# Altium project arm.PrjPcb
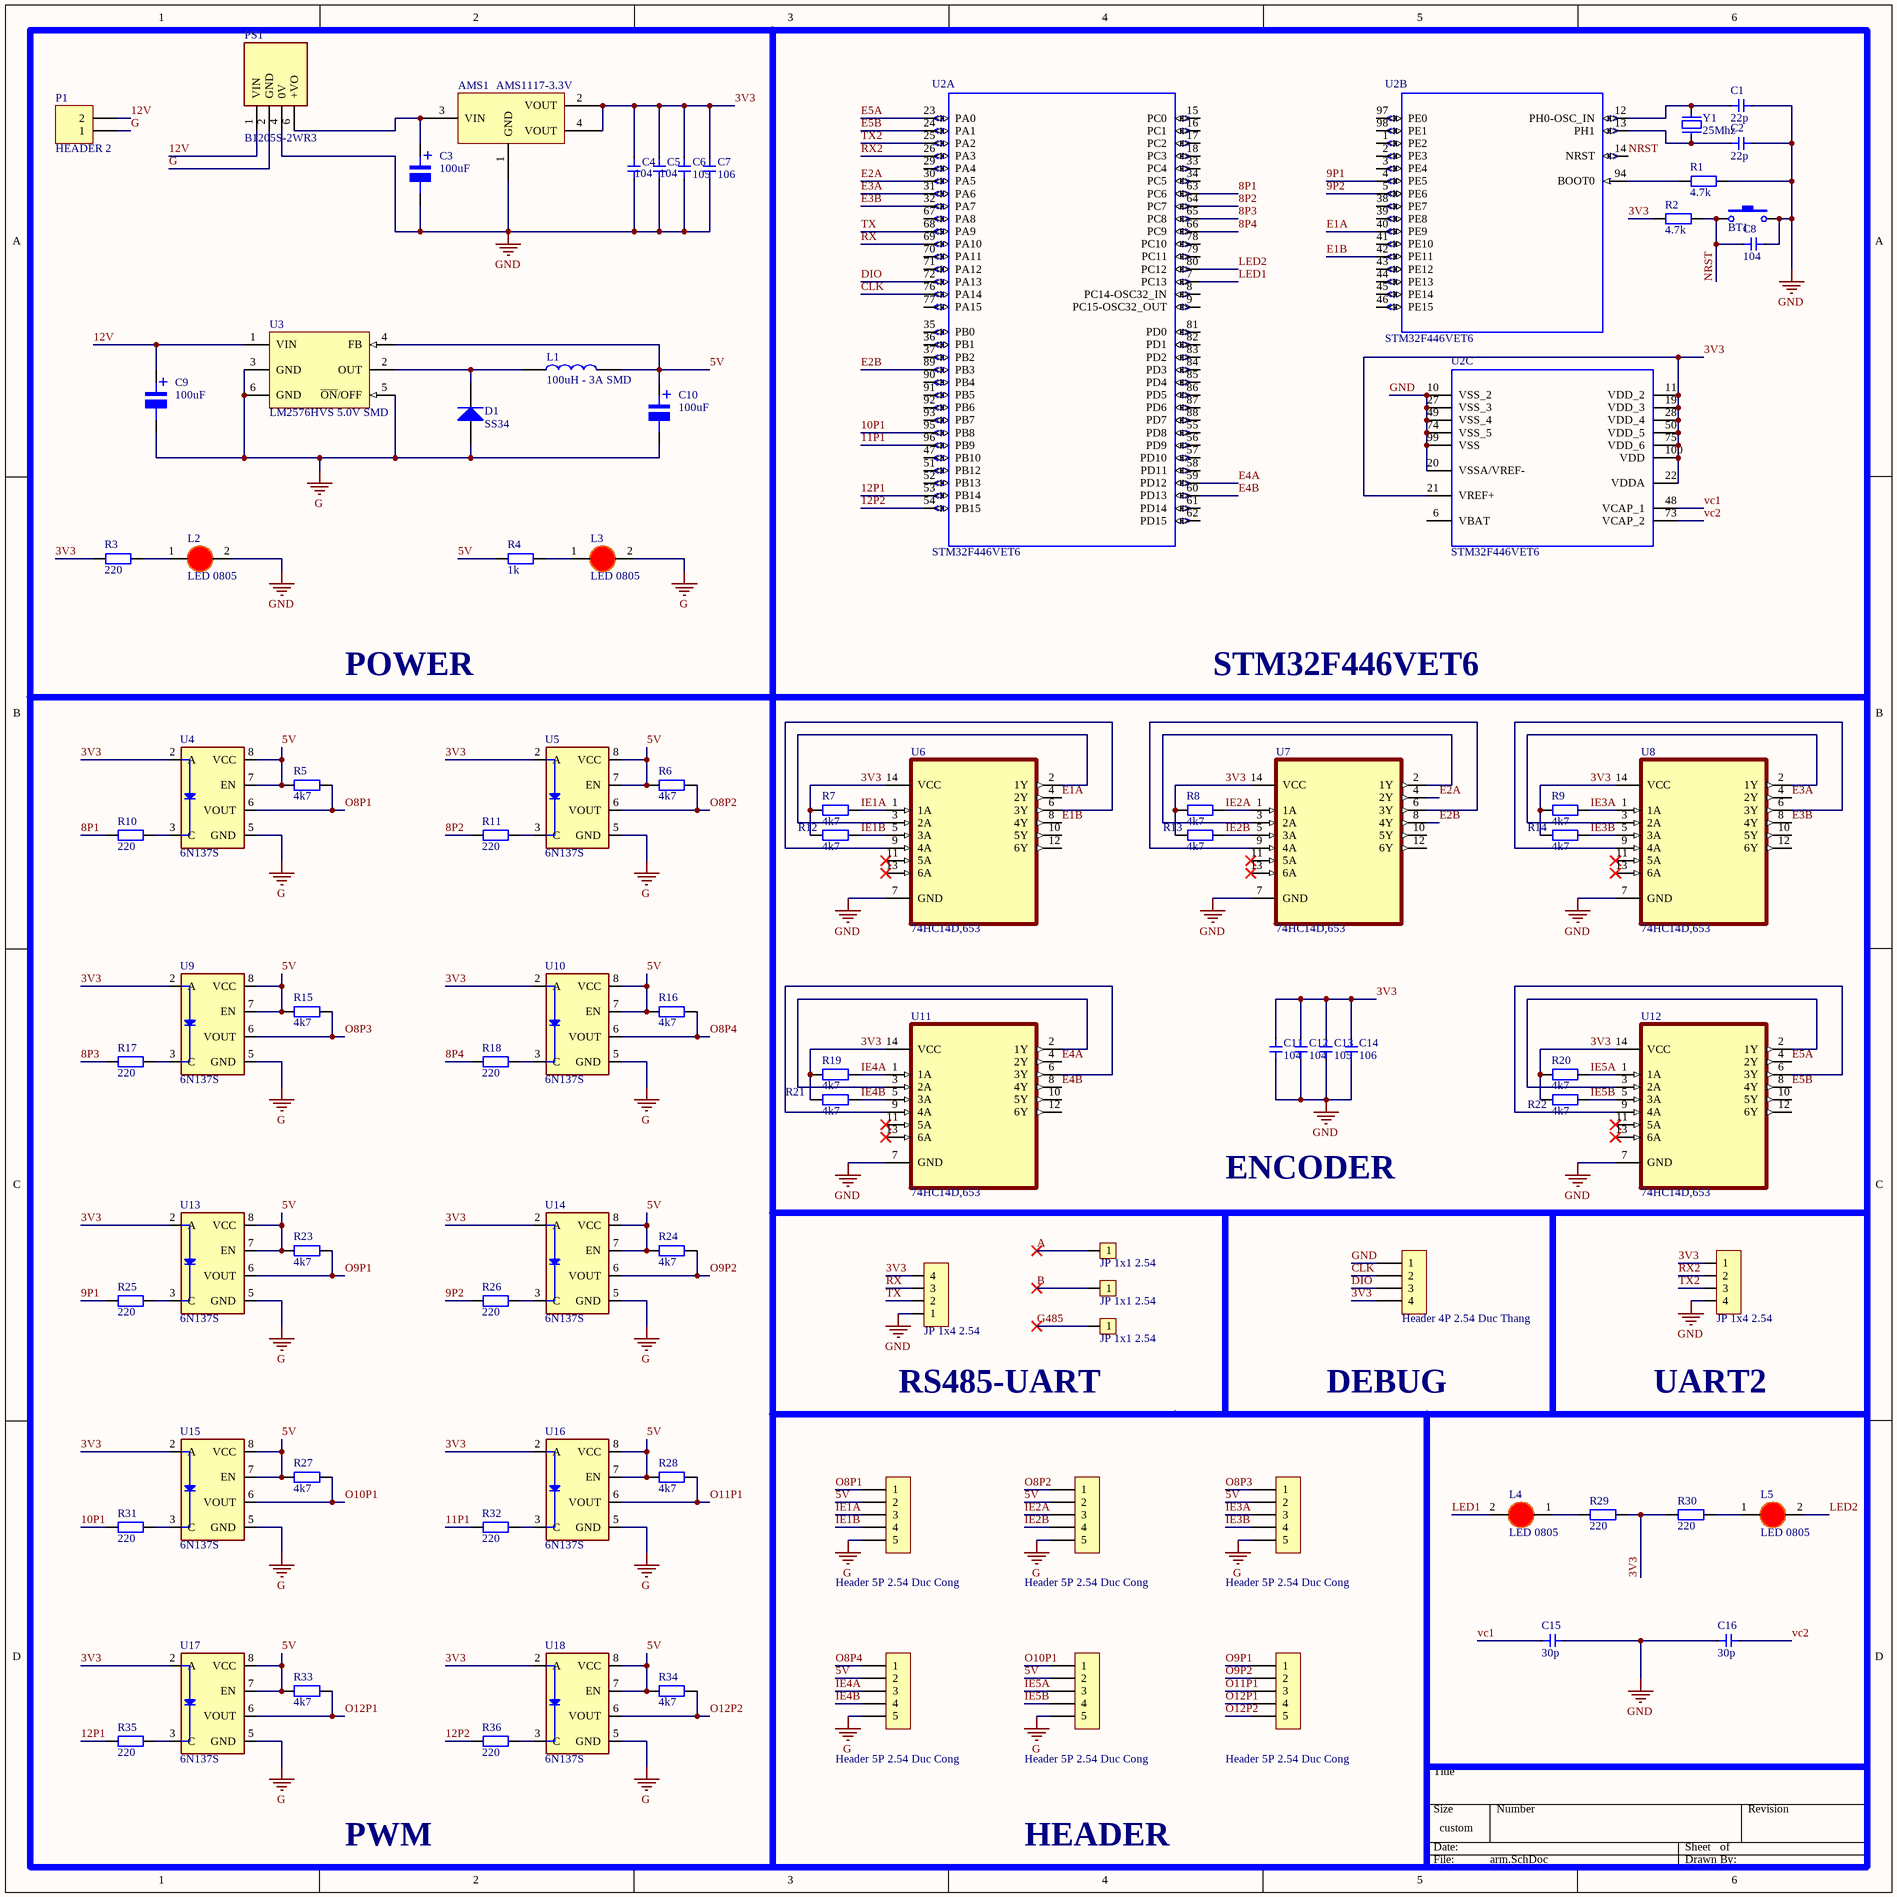
[diagram p0: arm.SchDoc]
1 sheet, 92 parts. Net scope: global (net labels, ports and power ports of the same name join across sheets).
Board file: arm.PcbDoc

## Sheet arm.SchDoc
size 381 x 381 mm; SheetNumber: 1; SheetTotal: 1

### Parts
AMS1  AMS1117-3.3V  [SOT223]
BT1  Nut Nhan 2 Chan SMD 3x6x2.5  [Nut Nhan 2 Chan SMD 3x6x2.5]  (value not drawn)
C1  22p  [Cap 0805]
C2  22p  [Cap 0805]
C3  100uF  [tu nhom 6.3 (d)]
C4  104  [Cap 0805]
C5  104  [Cap 0805]
C6  105  [Cap 0805]
C7  106  [Cap 0805]
C8  104  [Cap 0805]
C9  100uF  [tu nhom 6.3 (d)]
C10  100uF  [tu nhom 6.3 (d)]
C11  104  [Cap 0805]
C12  104  [Cap 0805]
C13  105  [Cap 0805]
C14  106  [Cap 0805]
C15  30p  [Cap 0805]
C16  30p  [Cap 0805]
D1  SS34  [DIODE SMA]
H1  Header 4P 2.54 Duc Thang  [XH2.54M-4]
H2  Header 5P 2.54 Duc Cong  [Header 5P DC 2.54]
H3  Header 5P 2.54 Duc Cong  [Header 5P DC 2.54]
H4  Header 5P 2.54 Duc Cong  [Header 5P DC 2.54]
H5  Header 5P 2.54 Duc Cong  [Header 5P DC 2.54]
H6  Header 5P 2.54 Duc Cong  [Header 5P DC 2.54]
H7  Header 5P 2.54 Duc Cong  [Header 5P DC 2.54]
JP1  JP 1x1 2.54  [JP 1x1 DT]
JP2  JP 1x4 2.54  [JP 1x4 DT]
JP3  JP 1x4 2.54  [JP 1x4 DT]
JP4  JP 1x1 2.54  [JP 1x1 DT]
JP5  JP 1x1 2.54  [JP 1x1 DT]
L1  100uH - 3A SMD  [Cuon Cam 12x12x10]
L2  LED 0805  [LED-0805-Red]
L3  LED 0805  [LED-0805-Red]
L4  LED 0805  [LED-0805-Red]
L5  LED 0805  [LED-0805-Red]
P1  HEADER 2  [CON 2]
PS1  B1205S-2WR3  [B1205S2WR3]
R1  4.7k  [tro smd 0805]
R2  4.7k  [tro smd 0805]
R3  220  [tro smd 0805]
R4  1k  [tro smd 0805]
R5  4k7  [tro smd 0805]
R6  4k7  [tro smd 0805]
R7  4k7  [tro smd 0805]
R8  4k7  [tro smd 0805]
R9  4k7  [tro smd 0805]
R10  220  [tro smd 0805]
R11  220  [tro smd 0805]
R12  4k7  [tro smd 0805]
R13  4k7  [tro smd 0805]
R14  4k7  [tro smd 0805]
R15  4k7  [tro smd 0805]
R16  4k7  [tro smd 0805]
R17  220  [tro smd 0805]
R18  220  [tro smd 0805]
R19  4k7  [tro smd 0805]
R20  4k7  [tro smd 0805]
R21  4k7  [tro smd 0805]
R22  4k7  [tro smd 0805]
R23  4k7  [tro smd 0805]
R24  4k7  [tro smd 0805]
R25  220  [tro smd 0805]
R26  220  [tro smd 0805]
R27  4k7  [tro smd 0805]
R28  4k7  [tro smd 0805]
R29  220  [tro smd 0805]
R30  220  [tro smd 0805]
R31  220  [tro smd 0805]
R32  220  [tro smd 0805]
R33  4k7  [tro smd 0805]
R34  4k7  [tro smd 0805]
R35  220  [tro smd 0805]
R36  220  [tro smd 0805]
U2  STM32F446VET6  [LQFP100-14X14MM]  (parts A,B,C of 3)
U3  LM2576HVS 5.0V SMD  [TO263-5]
U4  6N137S  [8-SMD]
U5  6N137S  [8-SMD]
U6  74HC14D,653  [SOIC127P600X175-14N]
U7  74HC14D,653  [SOIC127P600X175-14N]
U8  74HC14D,653  [SOIC127P600X175-14N]
U9  6N137S  [8-SMD]
U10  6N137S  [8-SMD]
U11  74HC14D,653  [SOIC127P600X175-14N]
U12  74HC14D,653  [SOIC127P600X175-14N]
U13  6N137S  [8-SMD]
U14  6N137S  [8-SMD]
U15  6N137S  [8-SMD]
U16  6N137S  [8-SMD]
U17  6N137S  [8-SMD]
U18  6N137S  [8-SMD]
Y1  25Mhz  [Thach Anh 2 chan cam]

### Blocks framed on the sheet
POWER: AMS1 C3-C7 C9 C10 D1 L1-L3 P1 PS1 R3 R4 U3

### Nets
G: C9.2 C10.2 D1.1(A) H2.5 H3.5 H4.5 H5.5 H6.5 L3.2(K) P1.1 PS1.2(GND) U3.3(GND) U3.5(~{ON}/OFF) U3.6(GND) U4.5(GND) U5.5(GND) U9.5(GND) U10.5(GND) U13.5(GND) U14.5(GND) U15.5(GND) U16.5(GND) U17.5(GND) U18.5(GND)
GND: AMS1.1(GND) BT1.2 C1.2 C2.2 C3.2 C4.2 C5.2 C6.2 C7.2 C8.2 C11.2 C12.2 C13.2 C14.2 C15.2 C16.1 H1.1 JP2.1 JP3.4 L2.2(K) PS1.4(0V) R1.2 U2.10(VSS_2) U2.20(VSSA/VREF-) U2.27(VSS_3) U2.49(VSS_4) U2.74(VSS_5) U2.99(VSS) U6.7(GND) U7.7(GND) U8.7(GND) U11.7(GND) U12.7(GND)
3V3: AMS1.2(VOUT) AMS1.4(VOUT) C4.1 C5.1 C6.1 C7.1 C11.1 C12.1 C13.1 C14.1 H1.4 JP2.4 JP3.1 R2.2 R3.1 R7.1 R8.1 R9.1 R12.1 R13.1 R14.1 R19.1 R20.1 R21.1 R22.1 R29.2 R30.1 U2.11(VDD_2) U2.19(VDD_3) U2.21(VREF+) U2.22(VDDA) U2.28(VDD_4) U2.50(VDD_5) U2.75(VDD_6) U2.100(VDD) U4.2(A) U5.2(A) U6.14(VCC) U7.14(VCC) U8.14(VCC) U9.2(A) U10.2(A) U11.14(VCC) U12.14(VCC) U13.2(A) U14.2(A) U15.2(A) U16.2(A) U17.2(A) U18.2(A)
5V: C10.1 H2.2 H3.2 H4.2 H5.2 H6.2 L1.2 R4.1 R5.1 R6.1 R15.1 R16.1 R23.1 R24.1 R27.1 R28.1 R33.1 R34.1 U3.4(FB) U4.7(EN) U4.8(VCC) U5.7(EN) U5.8(VCC) U9.7(EN) U9.8(VCC) U10.7(EN) U10.8(VCC) U13.7(EN) U13.8(VCC) U14.7(EN) U14.8(VCC) U15.7(EN) U15.8(VCC) U16.7(EN) U16.8(VCC) U17.7(EN) U17.8(VCC) U18.7(EN) U18.8(VCC)
8P1: R10.1 U2.63(PC6)
8P2: R11.1 U2.64(PC7)
8P3: R17.1 U2.65(PC8)
8P4: R18.1 U2.66(PC9)
9P1: R25.1 U2.4(PE5)
9P2: R26.1 U2.5(PE6)
10P1: R31.1 U2.95(PB8)
11P1: R32.1 U2.96(PB9)
12P1: R35.1 U2.53(PB14)
12P2: R36.1 U2.54(PB15)
12V: C9.1 P1.2 PS1.1(VIN) U3.1(VIN)
A: JP1.1
B: JP4.1
CLK: H1.2 U2.76(PA14)
DIO: H1.3 U2.72(PA13)
E1A: U2.40(PE9) U6.4(2Y)
E1B: U2.42(PE11) U6.8(4Y)
E2A: U2.30(PA5) U7.4(2Y)
E2B: U2.89(PB3) U7.8(4Y)
E3A: U2.31(PA6) U8.4(2Y)
E3B: U2.32(PA7) U8.8(4Y)
E4A: U2.59(PD12) U11.4(2Y)
E4B: U2.60(PD13) U11.8(4Y)
E5A: U2.23(PA0) U12.4(2Y)
E5B: U2.24(PA1) U12.8(4Y)
G485: JP5.1
IE1A: H2.3 R7.2 U6.1(1A)
IE1B: H2.4 R12.2 U6.5(3A)
IE2A: H3.3 R8.2 U7.1(1A)
IE2B: H3.4 R13.2 U7.5(3A)
IE3A: H4.3 R9.2 U8.1(1A)
IE3B: H4.4 R14.2 U8.5(3A)
IE4A: H5.3 R19.2 U11.1(1A)
IE4B: H5.4 R21.2 U11.5(3A)
IE5A: H6.3 R20.2 U12.1(1A)
IE5B: H6.4 R22.2 U12.5(3A)
LED1: L4.2(K) U2.7(PC13)
LED2: L5.2(K) U2.80(PC12)
NRST: BT1.1 C8.1 R2.1 U2.14(NRST)
O8P1: H2.1 R5.2 U4.6(VOUT)
O8P2: H3.1 R6.2 U5.6(VOUT)
O8P3: H4.1 R15.2 U9.6(VOUT)
O8P4: H5.1 R16.2 U10.6(VOUT)
O9P1: H7.1 R23.2 U13.6(VOUT)
O9P2: H7.2 R24.2 U14.6(VOUT)
O10P1: H6.1 R27.2 U15.6(VOUT)
O11P1: H7.3 R28.2 U16.6(VOUT)
O12P1: H7.4 R33.2 U17.6(VOUT)
O12P2: H7.5 R34.2 U18.6(VOUT)
RX: JP2.3 U2.69(PA10)
RX2: JP3.2 U2.26(PA3)
TX: JP2.2 U2.68(PA9)
TX2: JP3.3 U2.25(PA2)
vc1: C15.1 U2.48(VCAP_1)
vc2: C16.2 U2.73(VCAP_2)
NetAMS1_3: AMS1.3(VIN) C3.1 PS1.6(+VO)
NetC1_1: C1.1 U2.12(PH0-OSC_IN) Y1.2
NetC2_1: C2.1 U2.13(PH1) Y1.1
NetD1_2: D1.2(K) L1.1 U3.2(OUT)
NetL2_1: L2.1(A) R3.2
NetL3_1: L3.1(A) R4.2
NetL4_1: L4.1(A) R29.1
NetL5_1: L5.1(A) R30.2
NetR1_1: R1.1 U2.94(BOOT0)
NetR10_2: R10.2 U4.3(C)
NetR11_2: R11.2 U5.3(C)
NetR17_2: R17.2 U9.3(C)
NetR18_2: R18.2 U10.3(C)
NetR25_2: R25.2 U13.3(C)
NetR26_2: R26.2 U14.3(C)
NetR31_2: R31.2 U15.3(C)
NetR32_2: R32.2 U16.3(C)
NetR35_2: R35.2 U17.3(C)
NetR36_2: R36.2 U18.3(C)
NetU6_2: U6.2(1Y) U6.3(2A)
NetU6_6: U6.6(3Y) U6.9(4A)
NetU7_2: U7.2(1Y) U7.3(2A)
NetU7_6: U7.6(3Y) U7.9(4A)
NetU8_2: U8.2(1Y) U8.3(2A)
NetU8_6: U8.6(3Y) U8.9(4A)
NetU11_2: U11.2(1Y) U11.3(2A)
NetU11_6: U11.6(3Y) U11.9(4A)
NetU12_2: U12.2(1Y) U12.3(2A)
NetU12_6: U12.6(3Y) U12.9(4A)

Not connected (* = marked no-connect by the designer): U2 1(PE2) 2(PE3) 3(PE4) 6(VBAT) 8(PC14-OSC32_IN) 9(PC15-OSC32_OUT) 15(PC0) 16(PC1) 17(PC2) 18(PC3) 29(PA4) 33(PC4) 34(PC5) 35(PB0) 36(PB1) 37(PB2) 38(PE7) 39(PE8) 41(PE10) 43(PE12) 44(PE13) 45(PE14) 46(PE15) 47(PB10) 51(PB12) 52(PB13) 55(PD8) 56(PD9) 57(PD10) 58(PD11) 61(PD14) 62(PD15) 67(PA8) 70(PA11) 71(PA12) 77(PA15) 78(PC10) 79(PC11) 81(PD0) 82(PD1) 83(PD2) 84(PD3) 85(PD4) 86(PD5) 87(PD6) 88(PD7) 90(PB4) 91(PB5) 92(PB6) 93(PB7) 97(PE0) 98(PE1); U6 10(5Y) 11(5A)* 12(6Y) 13(6A)*; U7 10(5Y) 11(5A)* 12(6Y) 13(6A)*; U8 10(5Y) 11(5A)* 12(6Y) 13(6A)*; U11 10(5Y) 11(5A)* 12(6Y) 13(6A)*; U12 10(5Y) 11(5A)* 12(6Y) 13(6A)*

### Notes on the sheet
- STM32F446VET6
- ENCODER
- RS485-UART
- DEBUG
- UART2
- PWM
- HEADER
- (in symbol Tu Nhom 100uF 16V) +
- (in symbol Tu Nhom 100uF 25V) +

### Library data of the parts
AMS1 = AMS1117 SMD: Dán; Value: AMS1117-3.3V SOT223; Don_Vi: Con; Ma_Hang: MH000596; Ghi_Chu: *; Kieu_Chan: *; Chung_Loai: Dán
BT1 = Nut Nhan 2 Chan SMD 3x6x2.5: Ma_Hang: MH001036; Ten: Nút Nhấn 2 Chân 3x6x2.5MM SMD
C1 C2 C4-C8 C11-C16 = Cap 0805: Capacitor SMD 0805
C3 C10 = Tu Nhom 100uF 16V: Dán; Don_Vi: Con; So_Chan: 2; Ten_Linh_Kien: Tụ Nhôm 100uF 16V 6.3x5.4MM; Ma_Hang: MH002219; Chung_Loai: Dán; Kieu_Chan: *
C9 = Tu Nhom 100uF 25V: Dán; Don_Vi: Con; So_Chan: 2; Ten_Linh_Kien: Tụ Nhôm 100uF 25V 6x7MM; Ma_Hang: MH002222; Chung_Loai: Dán; Kieu_Chan: *
D1 = Diode SS34 ( 1N5822 ): Dán; Don_Vi: Con; Ma_Hang: MH002104; Ten_Linh_Kien: Diode SS34 3A 40V SMA ( 1N5822 SS34A); Kieu_Chan: *; Chung_Loai: Dán
H1 = Header 4P 2.54 Duc Thang: Cắm; Ten_Linh_Kien: Header 4P XH2.54-4P Đực Thẳng; Don_Vi: Con; Ma_Hang: MH001285; Chung_Loai: Cắm
H2-H7 = Header 5P 2.54 Duc Cong: Cắm; Ten_Linh_Kien: Header 5P XH2.54-5P Đực Cong; Don_Vi: Con; Ma_Hang: MH001308; Chung_Loai: Cắm
JP1 JP4 JP5 = JP 1x1 2.54 Duc Cong: Cắm; Ten_Linh_Kien: Jump Đơn Đực 2.54MM 1x40P Cong Đứng; Don_Vi: Con; Ma_Hang: MH000904; Ghi_Chu: *; Kieu_Chan: *; Chung_Loai: Cắm
JP2 JP3 = JP 1x4 2.54 Duc Thang: Cắm; Ten_Linh_Kien: Jump Đơn Đực 2.54MM 1x40P Thẳng 11MM; Don_Vi: Con; Ma_Hang: MH000903; Ghi_Chu: *; Kieu_Chan: *; Chung_Loai: Cắm
L1 = CUON CAM 100uH SMD: Dán; Don_Vi: Con; Ma_Hang: MH003999; Ten_Linh_Kien: Cuộn Cảm 100uH 7x7x4MM CD74; Ma_Hang: *; Kieu_Chan: *; Chung_Loai: Dán
L2-L5 = LED 0805 Do: Dán; Don_Vi: Con; Ma_Hang: MH000897; Ten_Linh_Kien: LED 0805 Màu Đỏ (Red); Ghi_Chu: *; Kieu_Chan: *; Chung_Loai: Dán
PS1 = B1205S-2WR3: Power Supply; Manufacturer_Name: Mornsun Power; Datasheet Link: https://www.mornsun-power.com/html/pdf/B1205S-2WR3.html; Height: 10.41mm; Manufacturer_Part_Number: B1205S-2WR3
R1-R36 = Tro 0805 1% 0.22R: Dán; Don_Vi: Con; So_Chan: 2; Ten_Linh_Kien: Trở 0805 1% 0.22R; Ma_Hang: MH005466; Chung_Loai: Dán; Kieu_Chan: *
U2 = STM32F446VET6: ARMÂ® CortexÂ®-M4 STM32F4 Microcontroller IC 32-Bit Single-Core 180MHz 512KB (512K x 8) FLASH 100-LQFP (14x14); MF: STMicroelectronics; SnapEDA_Link: https://www.snapeda.com/parts/STM32F446VET6/STMicroelectronics/view-part/?ref=snap; Package: LQFP-100 STMicroelectronics; Value: *; MP: STM32F446VET6; Check_prices: https://www.snapeda.com/parts/STM32F446VET6/STMicroelectronics/view-part/?ref=eda
U3 = LM2576HVS 5.0V SMD: Dán; Ten_Linh_Kien: LM2576HVS-5.0V BUCK 5V 3A TO263-5; Don_Vi: Con; Ma_Hang: MH002362; Ghi_Chu: *; Kieu_Chan: *; Chung_Loai: Dán
U4 U5 U9 U10 U13-U18 = 6N137S: Logic Output Optoisolator 15MBd Open Collector 5000Vrms 1 Channel 10kV/Âµs CMTI 8-SMD; MF: Lite-On Inc.; SnapEDA_Link: https://www.snapeda.com/parts/6N137S/Lite-On/view-part/?ref=snap; Package: SMD-8 Lite-On Inc.; Value: *; MP: 6N137S; Check_prices: https://www.snapeda.com/parts/6N137S/Lite-On/view-part/?ref=eda
U6-U8 U11 U12 = 74HC14D,653: Inverter IC 6 Channel Schmitt Trigger 14-SO; MF: Nexperia USA; SnapEDA_Link: https://www.snapeda.com/parts/74HC14D,653/Nexperia/view-part/?ref=snap; Package: SO14-14 Nexperia USA Inc.; Value: *; MP: 74HC14D,653; Check_prices: https://www.snapeda.com/parts/74HC14D,653/Nexperia/view-part/?ref=eda
Y1 = Thach Anh 2 chan Cam: Crystal For all Crystal 2pin.; Value: 4Mhz